# EAGLE design DotBar (EAGLE 7.7.0)
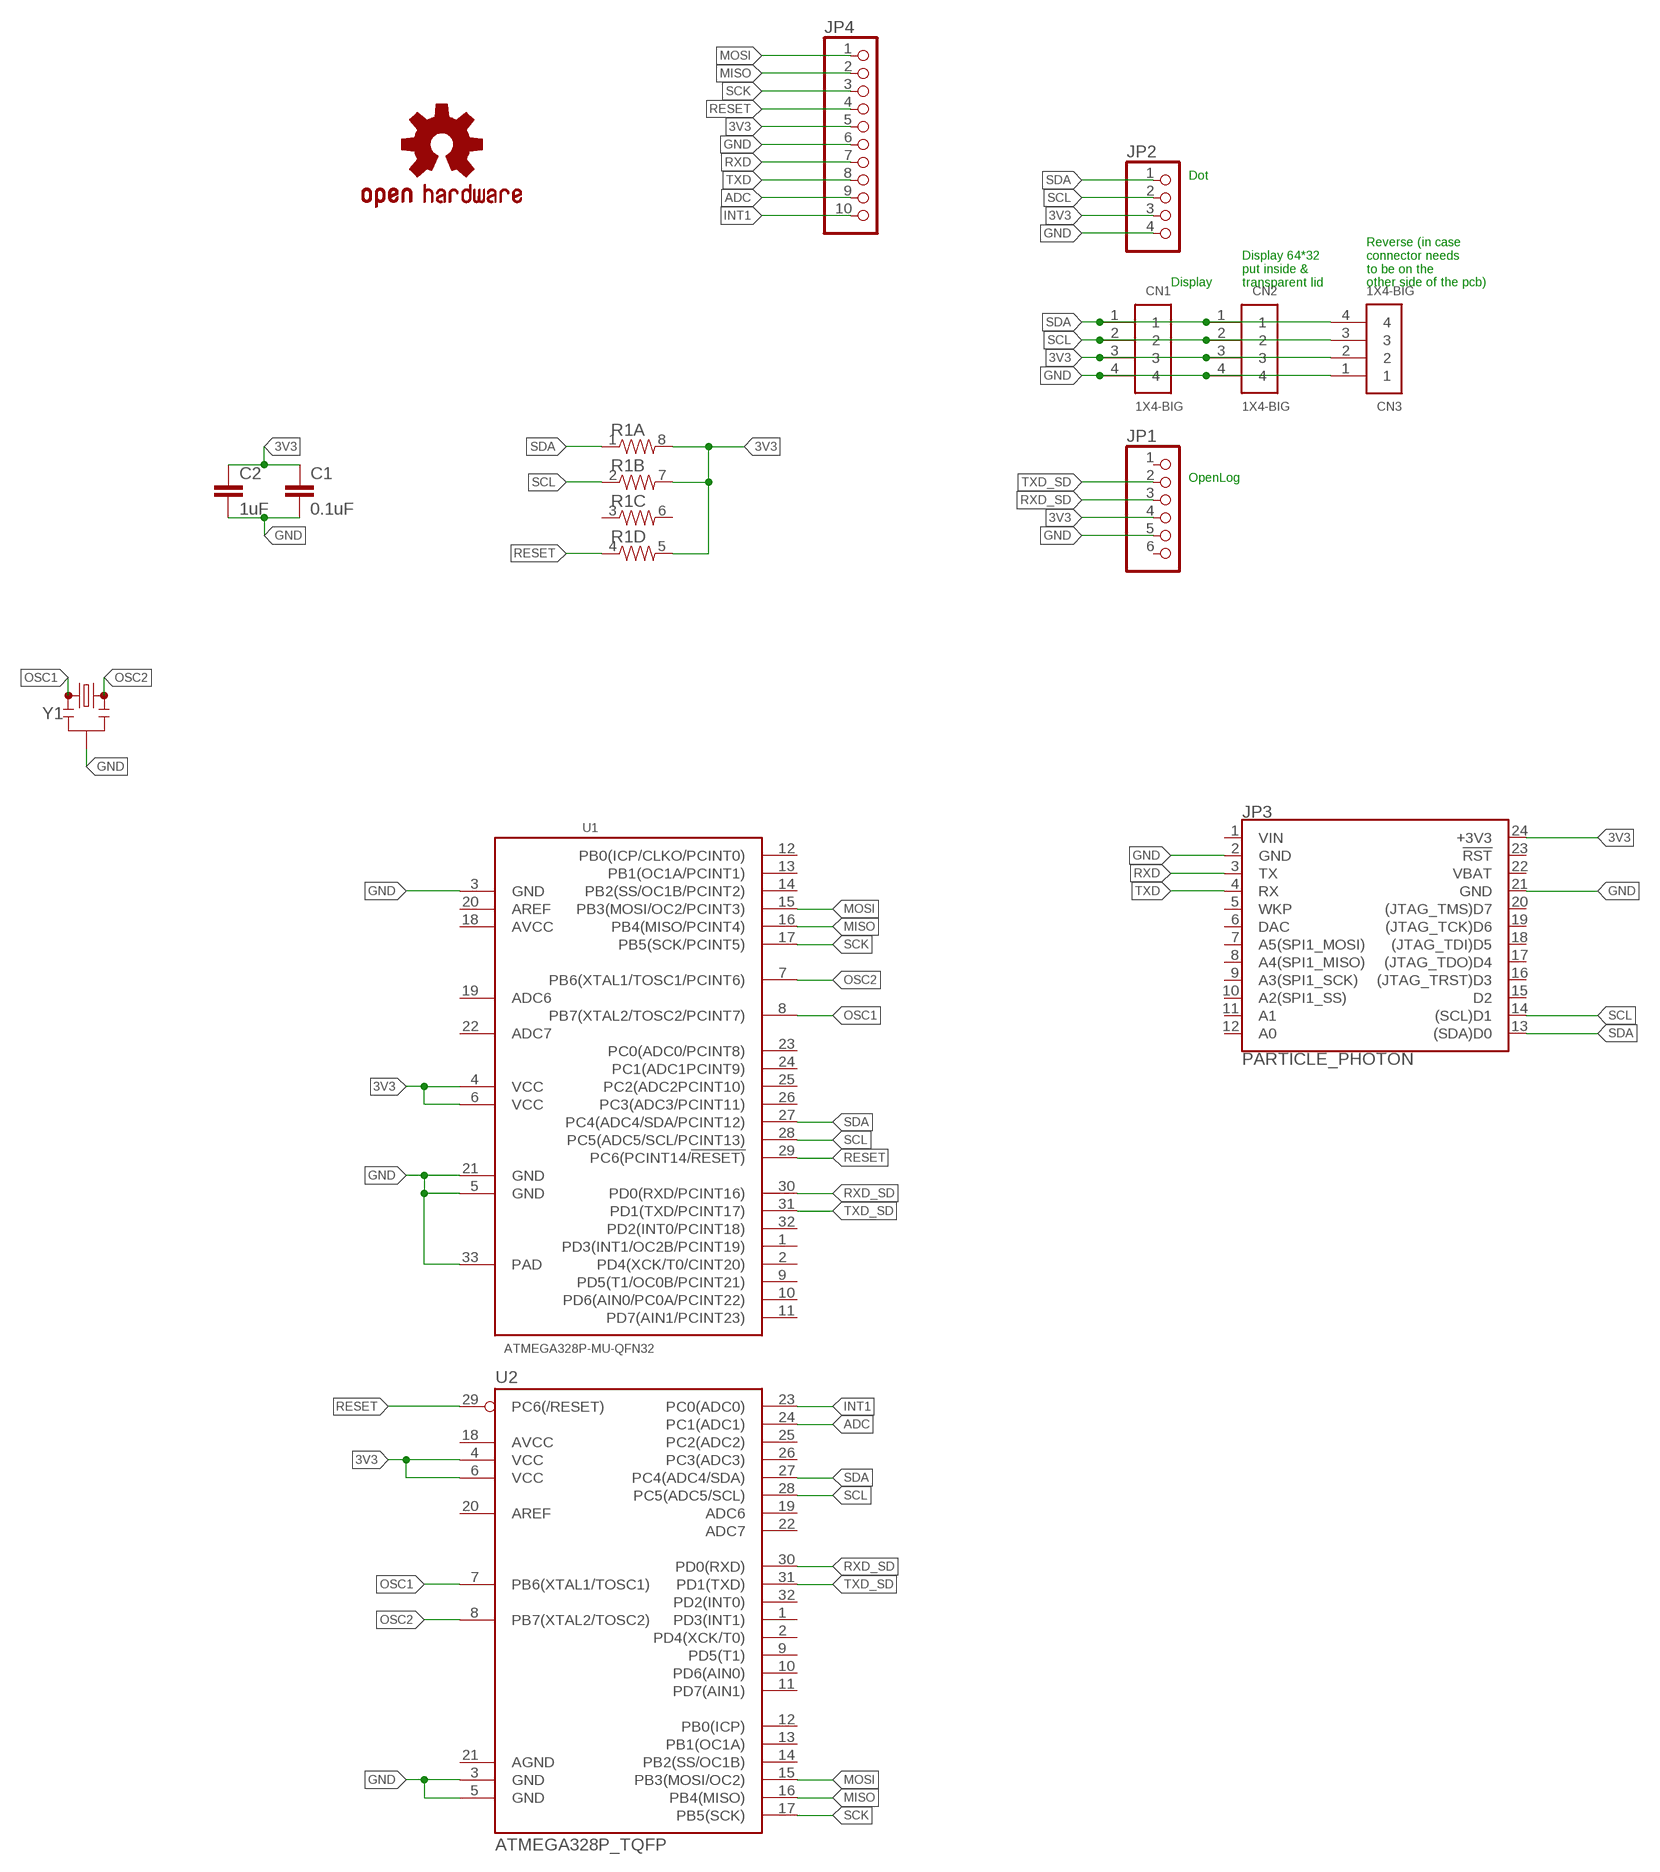
[diagram p0: schematic, sheet 1]

## Parts
C1  0.1uF  C-EUC0603  [C0603]
C2  1uF  C-EUC0603  [C0603]
CN1  1X4-BIG  [1X04-BIG]
CN2  1X4-BIG  [1X04-BIG]
CN3  1X4-BIG  [1X04-BIG]
JP1  PINHD-1X6  [1X06]
JP2  PINHD-1X4  [1X04]
JP3  PARTICLE_PHOTON  [PARTICLE_PHOTON]
JP4  PINHD-1X10  [1X10]
LOGO1  OSHW-LOGOS  [OSHW-LOGO-S]
R1  RESISTOR-ARRAY0603-ARV  [0603-ARV]
U1  ATMEGA328P-MU-QFN32  MCU-ATMEGA328P-MU(QFN32)  [QFN32G-0.5-5X5MM]
U2  ATMEGA328P_TQFP  [TQFP32-08]
Y1  RESONATORSMD-3.2X1.3  [RESONATOR-SMD-3.2X1.3]

## Nets
3V3: C1.1 C2.1 CN1.3 CN2.3 CN3.2 JP1.4 JP2.3 JP3.24(+3V3) JP4.5 R1.5 R1.7 R1.8 U1.4(VCC) U1.6(VCC) U2.4(VCC) U2.6(VCC)
ADC: JP4.9 U2.24(PC1(ADC1))
GND: C1.2 C2.2 CN1.4 CN2.4 CN3.1 JP1.5 JP2.4 JP3.2(GND) JP3.21(GND) JP4.6 U1.3(GND) U1.5(GND) U1.21(GND) U1.33(PAD) U2.3(GND) U2.5(GND) Y1.2
INT1: JP4.10 U2.23(PC0(ADC0))
MISO: JP4.2 U1.16(PB4(MISO/PCINT4)) U2.16(PB4(MISO))
MOSI: JP4.1 U1.15(PB3(MOSI/OC2/PCINT3)) U2.15(PB3(MOSI/OC2))
OSC1: U1.8(PB7(XTAL2/TOSC2/PCINT7)) U2.7(PB6(XTAL1/TOSC1)) Y1.1
OSC2: U1.7(PB6(XTAL1/TOSC1/PCINT6)) U2.8(PB7(XTAL2/TOSC2)) Y1.3
RESET: JP4.4 R1.4 U1.29(PC6(PCINT14/!RESET)) U2.29(PC6(/RESET))
RXD: JP3.3(TX) JP4.7
RXD_SD: JP1.3 U1.30(PD0(RXD/PCINT16)) U2.30(PD0(RXD))
SCK: JP4.3 U1.17(PB5(SCK/PCINT5)) U2.17(PB5(SCK))
SCL: CN1.2 CN2.2 CN3.3 JP2.2 JP3.14((SCL)D1) R1.2 U1.28(PC5(ADC5/SCL/PCINT13)) U2.28(PC5(ADC5/SCL))
SDA: CN1.1 CN2.1 CN3.4 JP2.1 JP3.13((SDA)D0) R1.1 U1.27(PC4(ADC4/SDA/PCINT12)) U2.27(PC4(ADC4/SDA))
TXD: JP3.4(RX) JP4.8
TXD_SD: JP1.2 U1.31(PD1(TXD/PCINT17)) U2.31(PD1(TXD))
Unconnected: JP1.1 JP1.6 JP3.5(WKP) JP3.6(DAC) JP3.7(A5(SPI1_MOSI)) JP3.8(A4(SPI1_MISO)) JP3.9(A3(SPI1_SCK)) JP3.10(A2(SPI1_SS)) JP3.11(A1) JP3.12(A0) JP3.15(D2) JP3.16((JTAG_TRST)D3) JP3.17((JTAG_TDO)D4) JP3.18((JTAG_TDI)D5) JP3.19((JTAG_TCK)D6) JP3.20((JTAG_TMS)D7) JP3.23(!RST!) R1.3 R1.6 U1.1(PD3(INT1/OC2B/PCINT19)) U1.2(PD4(XCK/T0/CINT20)) U1.9(PD5(T1/OC0B/PCINT21)) U1.10(PD6(AIN0/PC0A/PCINT22)) U1.11(PD7(AIN1/PCINT23)) U1.12(PB0(ICP/CLKO/PCINT0)) U1.13(PB1(OC1A/PCINT1)) U1.14(PB2(SS/OC1B/PCINT2)) U1.18(AVCC) U1.19(ADC6) U1.20(AREF) U1.22(ADC7) U1.23(PC0(ADC0/PCINT8)) U1.24(PC1(ADC1PCINT9)) U1.25(PC2(ADC2PCINT10)) U1.26(PC3(ADC3/PCINT11)) U1.32(PD2(INT0/PCINT18)) U2.1(PD3(INT1)) U2.2(PD4(XCK/T0)) U2.9(PD5(T1)) U2.10(PD6(AIN0)) U2.11(PD7(AIN1)) U2.12(PB0(ICP)) U2.13(PB1(OC1A)) U2.14(PB2(SS/OC1B)) U2.18(AVCC) U2.19(ADC6) U2.20(AREF) U2.21(AGND) U2.22(ADC7) U2.25(PC2(ADC2)) U2.26(PC3(ADC3)) U2.32(PD2(INT0))

## Notes on the sheet
- Dot
- Display
- Display 64*32 
  put inside & 
  transparent lid
- Reverse (in case 
  connector needs 
  to be on the 
  other side of the pcb)
- OpenLog

## Power pins joined to a net without a drawn wire
VBAT: JP3.22(VBAT)
VIN: JP3.1(VIN)

## Library data of the parts
C1 C2 = rcl:C-EU: CAPACITOR, European symbol
CN1-CN3 = adafruit:1X4: 4-pin connector
JP1 = adafruit:PINHD-1X6: PIN HEADER
JP2 = pinhead:PINHD-1X4: PIN HEADER
JP3 = SparkFun-Boards:PARTICLE_PHOTON: Particle Photon Footprint of the Particle Photon that is used as a basis for many Photon shields. SparkFun Products: Particle Photon <https://www.sparkfun.com/products/13764> SparkFun Photon ProtoShield <https://www.sparkfun.com/products/13598> SparkFun Photon micro OLED Shield <https://www.sparkfun.com/products/13628> SparkFun Photon IMU Shield <https://www.sparkfun.com/products/13629> SparkFun Photon Battery Shield <https://www.sparkfun.com/products/13626>
JP4 = pinhead:PINHD-1X10: PIN HEADER
LOGO1 = Spark:OSHW-LOGO: Open Source Hardware Logo This logo indicates the piece of hardware it is found on incorporates a OSHW license and/or adheres to the definition of open source hardware found here: http://freedomdefined.org/OSHW
R1 = SparkFun:RESISTOR-ARRAY: Array Chip Resistor Source: RS Component / Phycomp
U1 = Seeed-OPL-ic:MCU-ATMEGA328P-MU(QFN32): 310010005; MPN: ATMEGA328P-MU
U2 = SparkFun-IC-Microcontroller:ATMEGA328P_TQFP: Popular 328P in QFP Storefront component: ATmega328 - TQFP <https://www.sparkfun.com/products/13448> (COM-13448) Datasheet <http://www.sparkfun.com/datasheets/Components/SMD/ATMega328.pdf> SparkFun Products SparkFun RedBoard - Programmed with Arduino <https://www.sparkfun.com/products/12757> (DEV-12757) Arduino Pro Mini 328 - 5V/16MHz <https://www.sparkfun.com/products/11113> (DEV-11113) Arduino Pro Mini 328 - 3.3V/8MHz <https://www.sparkfun.com/products/11114> (DEV-11114) SparkFun OpenLog <https://www.sparkfun.com/products/13712> (DEV-13712) SparkFun MicroView - OLED Arduino Module <https://www.sparkfun.com/products/12923> (DEV-12923) SparkFun Digital Sandbox <https://www.sparkfun.com/products/12651> (DEV-12651) SparkFun PicoBoard <https://www.sparkfun.com/products/11888> (WIG-11888) Arduino Fio <https://www.sparkfun.com/products/10116> (DEV-10116) LilyPad Arduino 328 Main Board <https://www.sparkfun.com/products/13342> (DEV-13342) SparkFun RedStick <https://www.sparkfun.com/products/13741> (DEV-13741) LilyPad MP3 <https://www.sparkfun.com/products/11013> (DEV-11013) LilyPad Arduino SimpleSnap <https://www.sparkfun.com/products/10941> (DEV-10941) SparkFun Stepoko <https://www.sparkfun.com/products/13899> (ROB-13899) SparkFun Geiger Counter <https://www.sparkfun.com/products/11345> (SEN-11345) SparkFun EL Sequencer <https://www.sparkfun.com/products/12781> (COM-12781) Arduino Pro 328 - 5V/16MHz <https://www.sparkfun.com/products/10915> (DEV-10915) CryptoCape <https://www.sparkfun.com/products/12773> (DEV-12773) SparkFun IR Thermometer Evaluation Board - MLX90614 <https://www.sparkfun.com/products/10740> (SEN-10740) SparkFun RedBot Mainboard <https://www.sparkfun.com/products/12097> (ROB-12097) Arduino Pro 328 - 3.3V/8MHz <https://www.sparkfun.com/products/10914> (DEV-10914) SparkFun Block for Intel® Edison - Arduino <https://www.sparkfun.com/products/13036> (DEV-13036) SparkFun Simon Says - Surface Mount Soldering Kit <https://www.sparkfun.com/products/10935> (KIT-10935) SparkFun 7-Segment Serial Display - Red <https://www.sparkfun.com/products/11441> (COM-11441) SparkFun 7-Segment Serial Display - White <https://www.sparkfun.com/products/11629> (COM-11629) SparkFun 7-Segment Serial Display - Yellow <https://www.sparkfun.com/products/11443> (COM-11443) SparkFun 7-Segment Serial Display - Kelly Green <https://www.sparkfun.com/products/11440> (COM-11440) SparkFun 7-Segment Serial Display - Blue <https://www.sparkfun.com/products/11442> (COM-11442) SparkFun OpenSegment Serial Display - 20mm (Blue) <https://www.sparkfun.com/products/11647> (COM-11647) SparkFun OpenSegment Serial Display - 20mm (Green) <https://www.sparkfun.com/products/11646> (COM-11646) SparkFun OpenSegment Serial Display - 20mm (White) <https://www.sparkfun.com/products/11648> (COM-11648) SparkFun OpenSegment Serial Display - 20mm (Red) <https://www.sparkfun.com/products/11644> (COM-11644) SparkFun OpenSegment Serial Display - 20mm (Yellow) <https://www.sparkfun.com/products/11645> (COM-11645) SparkFun OpenSegment Shield <https://www.sparkfun.com/products/13190> (DEV-13190); PROD_ID: IC-09069
Y1 = SparkFun-Clocks:RESONATOR: Resonators (Generic) Ceramic resonators are clock-generating components, often used to control timing in microcontrollers. They usually have 3 pins: two pins for oscillation, and one pin for ground. Compared to crystals, resonators have worse tolerance, but are usually much cheaper. Plus, they have built-in load capacitors! These devices are used on boards like the Arduino Pro 8MHz <https://www.sparkfun.com/products/11114> and Arduino Pro 16MHz <https://www.sparkfun.com/products/11113>.

## Board
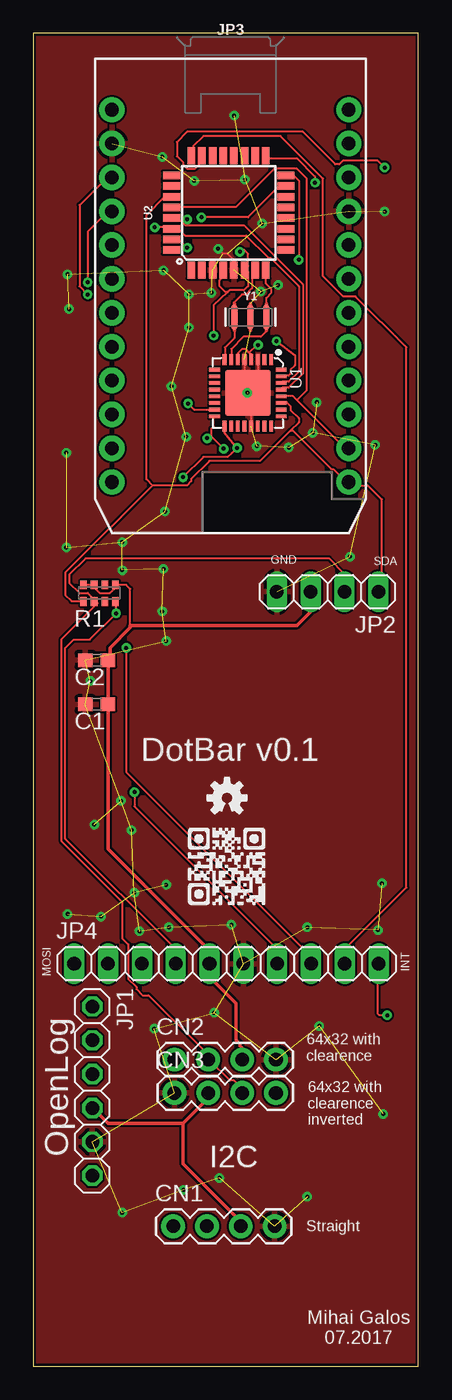
[diagram p1: board, top side]
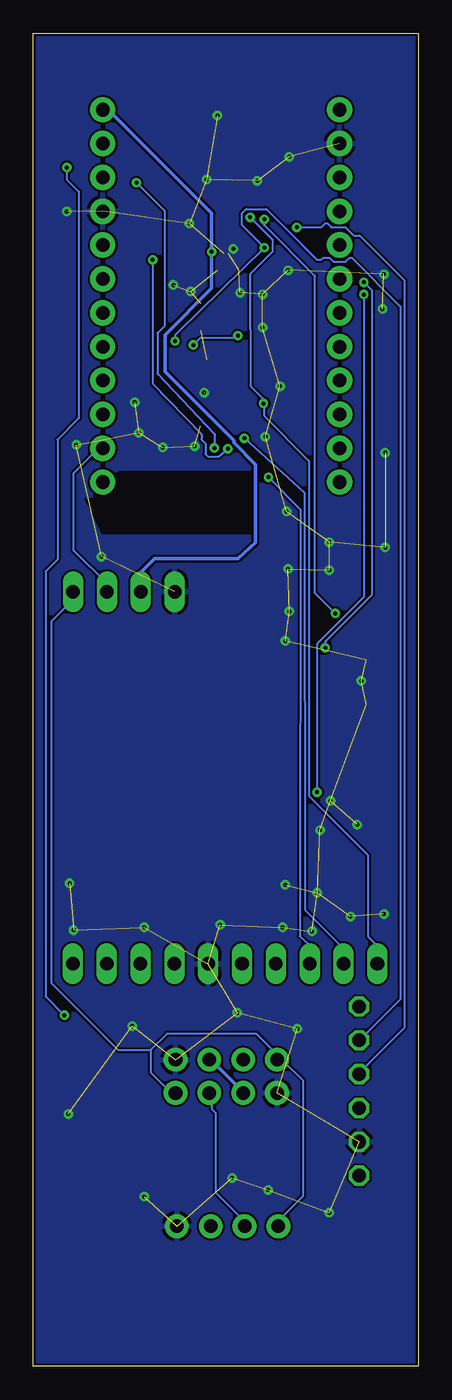
[diagram p2: board, bottom side, seen from below]

Size 28.9 x 100 mm. Coordinates in mm from the lower left corner, seen from the top.
Outline: 0,0 28.9,0 28.9,100 0,100 0,0
Copper layers (1*16): Top 0.035mm / dielectric 1.5mm / Bottom 0.035mm
Design rules "Mihai_default": minimum track width 6mil, minimum drill 0.3mm, track to track 6mil, track to pad 6mil, pad to pad 6mil, via to via 6mil, smd to smd 6mil, copper to edge 8mil, drill to drill 8mil, minimum pad ring 10mil, minimum via ring 8mil, stop-mask expansion 4mil, vias tented up to drill 0mil, thermal gap 10mil

### Footprints (pad centres in the part's own frame; a part is rotated, then mirrored left to right if it is on the bottom)
C0603 = smd 1.1 x 1: 1 -0.85,0; 2 0.85,0
1X04-BIG = drill 1.016 pad 1.778: 1 0,0; 2 2.54,0; 3 5.08,0; 4 7.62,0
1X06 = drill 1.016 octagon: 1 -6.35,0; 2 -3.81,0; 3 -1.27,0; 4 1.27,0; 5 3.81,0; 6 6.35,0
1X04 = drill 1.016 long: 1 -3.81,0; 2 -1.27,0; 3 1.27,0; 4 3.81,0
PARTICLE_PHOTON = drill 1.016 pad 1.905: 1 -8.89,13.97; 2 -8.89,11.43; 3 -8.89,8.89; 4 -8.89,6.35; 5 -8.89,3.81; 6 -8.89,1.27; 7 -8.89,-1.27; 8 -8.89,-3.81; 9 -8.89,-6.35; 10 -8.89,-8.89; 11 -8.89,-11.43; 12 -8.89,-13.97; 13 8.89,-13.97; 14 8.89,-11.43; 15 8.89,-8.89; 16 8.89,-6.35; 17 8.89,-3.81; 18 8.89,-1.27; 19 8.89,1.27; 20 8.89,3.81; 21 8.89,6.35; 22 8.89,8.89; 23 8.89,11.43; 24 8.89,13.97
1X10 = drill 1.016 long: 1 -11.43,0; 2 -8.89,0; 3 -6.35,0; 4 -3.81,0; 5 -1.27,0; 6 1.27,0; 7 3.81,0; 8 6.35,0; 9 8.89,0; 10 11.43,0
0603-ARV = smd 0.5 x 0.65: 1 -1.2,-0.625; 2 -0.4,-0.625; 3 0.4,-0.625; 4 1.2,-0.625; 5 1.2,0.625; 6 0.4,0.625; 7 -0.4,0.625; 8 -1.2,0.625
QFN32G-0.5-5X5MM = smd 0.813 x 0.279: 1 -2.5,1.75; 2 -2.5,1.25; 3 -2.5,0.75; 4 -2.5,0.25; 5 -2.5,-0.25; 6 -2.5,-0.75; 7 -2.5,-1.25; 8 -2.5,-1.75; 17 2.5,-1.75; 18 2.5,-1.25; 19 2.5,-0.75; 20 2.5,-0.25; 21 2.5,0.25; 22 2.5,0.75; 23 2.5,1.25; 24 2.5,1.75 | smd 0.279 x 0.813: 9 -1.75,-2.5; 10 -1.25,-2.5; 11 -0.75,-2.5; 12 -0.25,-2.5; 13 0.25,-2.5; 14 0.75,-2.5; 15 1.25,-2.5; 16 1.75,-2.5; 25 1.75,2.5; 26 1.25,2.5; 27 0.75,2.5; 28 0.25,2.5; 29 -0.25,2.5; 30 -0.75,2.5; 31 -1.25,2.5; 32 -1.75,2.5 | smd 3.429 x 3.429: 33 0,0
TQFP32-08 = smd 1.27 x 0.559: 1 -4.293,2.8; 2 -4.293,2; 3 -4.293,1.2; 4 -4.293,0.4; 5 -4.293,-0.4; 6 -4.293,-1.2; 7 -4.293,-2; 8 -4.293,-2.8; 17 4.293,-2.8; 18 4.293,-2; 19 4.293,-1.2; 20 4.293,-0.4; 21 4.293,0.4; 22 4.293,1.2; 23 4.293,2; 24 4.293,2.8 | smd 0.559 x 1.27: 9 -2.8,-4.293; 10 -2,-4.293; 11 -1.2,-4.293; 12 -0.4,-4.293; 13 0.4,-4.293; 14 1.2,-4.293; 15 2,-4.293; 16 2.8,-4.293; 25 2.8,4.293; 26 2,4.293; 27 1.2,4.293; 28 0.4,4.293; 29 -0.4,4.293; 30 -1.2,4.293; 31 -2,4.293; 32 -2.8,4.293
RESONATOR-SMD-3.2X1.3 = smd 0.45 x 1.905: 1 -1.2,0; 2 0,0; 3 1.2,0

### Placement (x,y rotation side)
C1  4.76,49.66 180 top
C2  4.76,52.97 180 top
CN1  10.5,10.5 0 top
CN2  10.6,23 0 top
CN3  10.6,20.5 0 top
JP1  4.43,20.64 270 top
JP2  22.1,58.1 180 top
JP3  14.8,80.3 0 top
JP4  14.5,30.2 0 top
LOGO1  14.54,42.64 0 top
R1  4.97,57.99 0 top
U1  16.11,73.02 270 top
U2  14.66,86.54 90 top
Y1  16.3,78.7 0 top

### Tracks (layer width: path | path; a pad name or v marks a point on that pad's centre or on a via)
3V3  (via drill 0.3)
  Top 0.152: 16.21,76.06 16.43,75.84 16.43,75.54 U1.4 | 16.21,76.06 15.97,76.3 15.66,76.3 15.36,75.99 U1.6 | v13.54,77.32 13.54,79.6 14.6,80.56 | 14.6,80.56 14.75,80.72 15.82,80.72 16.12,81.02 16.12,82.09 15.97,82.24 U2.6 15.97,82.39 16.12,82.55 16.12,83.46 15.82,83.77 15.66,83.77 v15.51,83.61 | 14.6,80.56 14.45,80.56 13.99,81.02 13.99,81.48 14.14,81.63 14.14,82.24 U2.4 | R1.8 4.54,58.62 R1.7 4.54,58.47 5,58.01 5.76,58.01 6.06,58.31 6.06,58.47 R1.5 6.22,58.62 6.98,58.62 7.28,58.31 7.28,55.57 | 5.61,49.78 C1.1 5.61,49.63 | 5.61,52.83 C2.1 5.76,52.98 | 15.51,24.02 15.51,24.18 | 15.66,23.11 CN2.3 | 4.54,19.3 JP1.4 | 13.07,20.37 CN3.2 | 13.23,30.27 JP4.5 | v16.88,76.62 16.78,76.62 16.21,76.06
  Top 0.279: 5.61,52.83 5.61,49.78 | 5.76,52.98 5.76,53.89 7.28,55.42 7.28,55.57 19.78,55.57 20.83,56.62 JP2.3 | 15.51,24.18 15.21,24.48 15.21,27.22 13.38,29.05 13.38,30.12 JP4.5 | 15.51,24.02 15.66,23.87 15.66,23.11 | 4.54,19.3 5.61,18.23 11.25,18.23 | 11.25,18.23 13.07,20.06 13.07,20.37 | 11.25,18.23 11.25,15.19 15.51,10.92 15.51,10.61 CN1.3 | 5.61,49.63 5.61,38.81 13.23,31.19 13.23,30.27
  Bottom 0.152: 15.66,22.96 CN2.3 | v13.54,77.32 13.54,77.27 13.68,77.12 16.38,77.12 v16.88,76.62
  Bottom 0.279: JP3.24 23.59,94.13 23.13,94.13 15.51,86.51 v15.51,83.61 15.51,80.87 19.02,77.36 19.02,74.62 13.84,69.44 13.84,69.29 12.21,67.66 12.24,61.79 13.53,60.6 19.78,60.6 20.83,59.55 JP2.3 | 15.66,22.96 15.21,22.5 15.05,22.5 13.07,20.52 CN3.2
ADC
  Top 0.152: U2.24 12.01,90.93 12.01,91.54 12.77,92.3 18.56,92.3 21.76,89.1 21.76,81.78 23.28,80.26 24.2,80.26 28.01,76.45 28.01,35.91 23.44,31.34 23.44,30.27 JP4.9
GND  (via drill 0.3)  (66 unrouted)
  Top 0.152: 15.82,75.36 15.97,73.1 U1.33 16.11,73.07 16.86,73.07 U1.3 | 15.82,75.36 U1.5 | 15.82,75.36 15.84,75.36 15.84,73.15 16.1,73.15 U1.33 16.36,73.02 U1.21 | U2.5 15.06,82.99 14.58,83.48 14.23,83.48 v13.88,83.83
  other vias: 13.98,14.13 11.28,13.22 6.68,11.53 20.58,12.72 26.28,18.92 21.48,25.52 13.58,26.52 9.08,25.33 10.18,32.92 5.08,33.73 2.58,33.92 7.98,32.62 7.58,35.52 9.98,36.12 14.88,33.12 20.58,32.92 26.18,36.23 25.88,32.73 7.38,40.23 6.58,42.42 4.58,40.62 4.28,51.42 9.98,54.42 9.68,56.62 9.88,64.12 9.78,59.82 23.78,60.73 25.68,69.12 2.48,68.53 10.38,73.53 16.78,69.03 19.18,68.93 20.98,70.03 21.28,72.33 16.08,73.03 11.48,69.73 11.68,77.93 11.68,80.43 9.78,82.23 18.38,81.12 17.18,85.73 12.08,88.93 15.88,89.03 9.68,90.73 15.08,93.83 26.38,86.62 2.58,81.93 2.68,79.33 6.68,61.82 6.68,59.73 2.48,61.43 17.08,80.62 13.38,80.53
  pour Bottom: 0,0 29,0 29,100 0,100
  pour Top: 0,0 29,0 29,100 0,100
INT1  (via drill 0.3)
  Top 0.152: U2.23 12.62,90.78 12.62,90.32 12.16,89.86 11.55,89.86 11.25,90.17 11.25,90.32 10.79,90.78 10.79,91.84 11.55,92.6 20.24,92.6 22.68,90.17 22.98,90.17 23.28,90.47 25.83,90.47 v26.38,89.93 | 26.03,30.27 JP4.10 25.88,30.15 25.88,26.42 25.98,26.33 v26.58,26.33
  Bottom 0.152: v26.38,89.93 26.38,89.03 25.48,88.12 25.48,71.12 27.08,69.53 27.08,60.52 27.98,59.62 27.98,27.73 v26.58,26.33
MISO  (via drill 0.3)
  Top 0.152: 13.38,69.74 13.38,70.35 13.53,70.51 13.53,71.27 U1.16 | v14.29,68.83 13.38,69.74 | v19.93,83 19.93,88.95 19.63,89.25 19.02,89.25 U2.16 | 13.38,69.74 v13.05,69.62
  Bottom 0.152: v14.29,68.83 14.98,68.23 15.78,68.23 15.98,68.43 15.98,69.23 16.08,69.33 16.28,69.53 16.28,69.93 19.93,73.71 v19.93,83 | v13.05,69.62 8.53,65.53 8.5,34.23 5.76,31.49 5.76,30.27 JP4.2
MOSI  (via drill 0.3)
  Top 0.152: v11.62,72.23 12.07,71.78 13.63,71.78 U1.15 | v12.62,86.2 16.12,86.2 18.41,88.49 18.87,88.49 U2.15
  Bottom 0.152: v12.62,86.2 10.94,84.53 10.94,83.61 12.62,81.94 12.58,73.53 11.62,72.57 v11.62,72.23 11.58,72.23 11.58,71.33 8.2,67.92 8.2,42.77 3.78,38.35 3.78,32.25 3.17,31.64 3.17,30.27 JP4.1
OSC1
  Top 0.152: 16.43,82.55 16.58,82.39 U2.7 16.58,82.24 16.43,82.09 16.43,80.87 15.97,80.41 15.66,80.41 15.05,79.8 Y1.1 | 15.1,77.68 15.1,77.15 14.38,76.43 14.38,75.54 U1.8
OSC2
  Top 0.152: 17.34,82.24 U2.8 17.48,82.23 17.48,81.23 17.88,80.83 17.88,80.53 17.49,80.14 17.49,79.8 Y1.3 | 17.5,77.68 17.5,77.65 17.08,77.23 15.78,77.23 14.88,76.33 14.88,75.54 U1.7
RESET  (via drill 0.3)
  Top 0.152: 11.25,85.75 10.94,86.05 10.48,86.05 U2.29 | 11.25,85.75 11.4,85.59 15.82,85.59 20.24,81.17 20.24,74.47 19.17,73.4 18.71,73.4 U1.29 | R1.4 6.22,57.25 v6.22,56.48 4.23,54.5 3.02,54.5 2.41,53.89 2.41,39.57 10.64,31.34 10.64,30.27 JP4.4 | v11.55,86.05 11.25,85.75
  Bottom 0.152: v11.55,86.05 11.55,85.59 7.74,81.78 7.74,58.01 v6.22,56.48
RXD  (via drill 0.3)
  Top 0.152: v7.59,43.07 7.59,42.01 18.26,31.34 18.26,30.27 JP4.7 | v4.08,80.41 3.47,81.02 3.47,87.12 5.45,89.1 5.76,89.1 JP3.3
  Bottom 0.152: v7.59,43.07 7.59,54.2 4.08,57.7 v4.08,80.41
RXD_SD  (via drill 0.3)
  Top 0.152: U1.30 18.71,73.86 19.17,73.86 19.93,74.62 19.93,81.02 17.8,83.16 17.65,83.16 15.97,84.83 11.4,84.83 10.94,85.29 10.48,85.29 U2.30 10.33,85.44 v9.11,85.44
  Bottom 0.152: v9.11,85.44 7.28,85.44 6.98,85.75 6.83,85.75 6.52,85.44 5.45,85.44 4.84,84.83 4.39,84.83 1.04,81.48 1.04,25.4 4.39,22.04 JP1.3
SCK  (via drill 0.3)
  Top 0.152: v21.15,88.79 21.15,89.25 19.78,90.62 17.65,90.62 17.49,90.78 U2.17 | U1.17 14.35,70.51 14.35,70.05 v15.3,68.89 14.9,68.53 14.6,68.22 12.77,68.22 v11.25,66.7
  Bottom 0.152: v15.3,68.89 15.28,69.95 19.58,74.47 19.58,77.52 19.04,78.05 19.04,86.69 v21.15,88.79 | v11.25,66.7 8.86,64.28 8.88,32.25 8.2,31.64 8.2,30.27 JP4.3
SCL
  Top 0.152: 19.78,72.49 23.28,68.98 23.59,68.98 JP3.14 | 19.78,72.49 19.48,72.79 18.71,72.79 U1.28 | 19.78,72.49 20.54,73.25 20.54,89.1 19.78,89.86 18.1,89.86 15.21,86.97 10.48,86.97 U2.28 | CN3.3 15.66,20.52 15.66,20.82 15.05,21.43 14.75,21.43 13.23,22.96 CN2.2 13.07,23.11 13.07,23.41 8.66,27.83 8.2,27.83 7.74,28.29 7.74,28.44 7.13,29.05 7.13,31.64 6.67,32.1 6.67,34.84 2.1,39.42 2.1,54.5 4.84,57.25 4.69,57.4 R1.2 4.54,57.4 4.54,57.55 4.08,58.01 3.47,58.01 2.71,58.77 2.71,59.38 3.93,60.6 22.22,60.6 23.37,59.45 JP2.2
  Bottom 0.152: CN1.2 13.07,10.61 13.07,10.92 15.21,13.05 15.21,18.99 15.51,19.3 15.51,20.21 15.66,20.37 CN3.3 | JP3.14 23.74,68.83 24.05,68.83 25.88,67 25.88,61.21 23.37,58.7 JP2.2
SDA
  Top 0.152: 8.96,66.09 2.41,59.53 2.41,57.86 2.86,57.4 3.62,57.4 R1.1 | 8.96,66.09 11.55,66.09 11.86,66.39 11.86,66.54 13.23,67.92 17.04,67.92 19.32,70.2 | 19.32,70.2 19.93,70.81 19.93,71.12 19.32,71.73 19.32,72.03 19.02,72.34 18.71,72.34 U1.27 | 8.96,66.09 8.5,66.54 8.5,86.36 9.87,87.73 10.33,87.73 U2.27 | 19.32,70.2 19.48,70.2 22.37,67.31 22.52,67.31 22.98,66.85 23.13,66.85 23.59,66.39 JP3.13 23.74,66.24 23.89,66.09 25.11,66.09 26.18,65.02 26.18,58.37 JP2.1
  Bottom 0.152: CN1.1 10.48,10.61 10.48,10.92 8.66,12.75 8.66,21.43 10.18,22.96 10.48,22.96 CN2.1 10.64,23.11 10.64,23.41 12.16,24.94 18.87,24.94 20.09,23.72 | 20.09,23.72 20.09,22.04 18.56,20.52 18.26,20.52 CN3.4 | 20.09,23.72 22.52,23.72 27.55,28.75 27.55,55.88 25.91,57.52 JP2.1
TXD  (via drill 0.3)
  Top 0.152: v6.98,53.89 6.98,44.6 20.85,30.73 20.85,30.27 JP4.8 | v4.08,81.33 4.08,85.14 5.45,86.51 5.76,86.51 JP3.4
  Bottom 0.152: v6.98,53.89 6.98,54.35 3.47,57.86 3.47,80.72 v4.08,81.33
TXD_SD  (via drill 0.3)
  Top 0.152: v18.26,76.91 19.63,75.84 19.63,75.08 19.32,74.77 19.32,74.47 19.17,74.32 18.71,74.32 U1.31 | v11.55,83.92 10.94,84.53 10.48,84.53 U2.31
  Bottom 0.152: v18.26,76.91 18.26,77.36 18.03,77.59 v11.55,83.92 13.23,85.59 13.23,86.51 12.92,86.81 11.4,86.81 7.59,83 7.28,83 7.13,83.16 6.67,83.16 6.37,82.85 5.45,82.85 5.15,83.16 5,83.16 1.34,79.5 1.34,27.53 4.39,24.48 JP1.2

### Text on the board
tPlace: GND | SDA | DotBar v0.1 | MOSI | INT | 64x32 with / clearence | 64x32 with / clearence / inverted | OpenLog | I2C | Straight | Mihai Galos / 07.2017